# EAGLE design Rtx_Power_Filter (EAGLE 6.5.0)
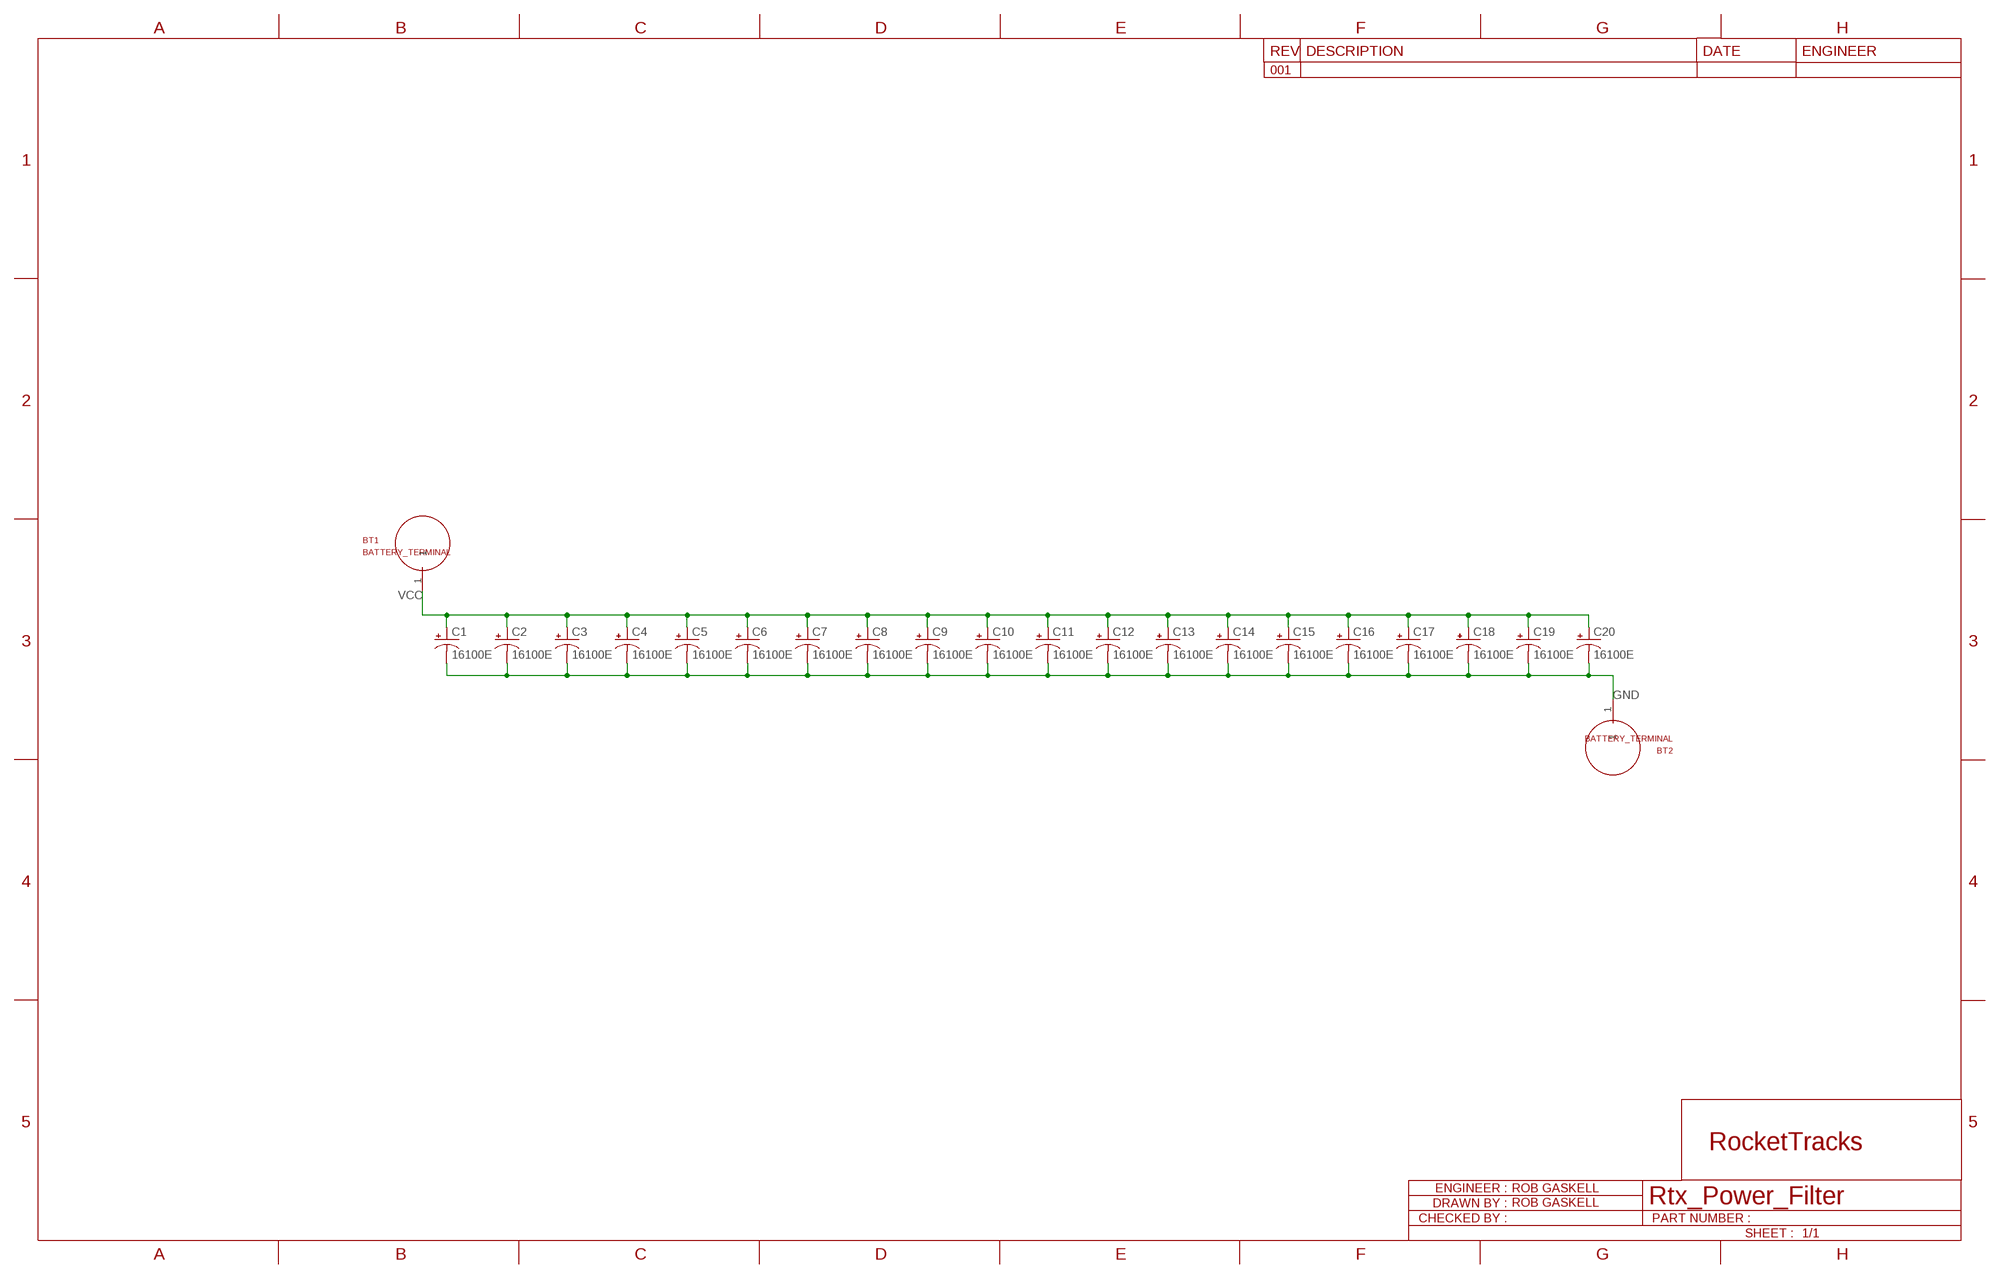
[diagram p0: schematic, sheet 1]

## Parts
BT1  BATTERY_TERMINAL  [BATTERY_TERMINAL]
BT2  BATTERY_TERMINAL  [BATTERY_TERMINAL]
C1  16100E  [16100]
C2  16100E  [16100]
C3  16100E  [16100]
C4  16100E  [16100]
C5  16100E  [16100]
C6  16100E  [16100]
C7  16100E  [16100]
C8  16100E  [16100]
C9  16100E  [16100]
C10  16100E  [16100]
C11  16100E  [16100]
C12  16100E  [16100]
C13  16100E  [16100]
C14  16100E  [16100]
C15  16100E  [16100]
C16  16100E  [16100]
C17  16100E  [16100]
C18  16100E  [16100]
C19  16100E  [16100]
C20  16100E  [16100]

## Nets
GND: BT2.1 C1.- C2.- C3.- C4.- C5.- C6.- C7.- C8.- C9.- C10.- C11.- C12.- C13.- C14.- C15.- C16.- C17.- C18.- C19.- C20.-
VCC: BT1.1 C1.+ C2.+ C3.+ C4.+ C5.+ C6.+ C7.+ C8.+ C9.+ C10.+ C11.+ C12.+ C13.+ C14.+ C15.+ C16.+ C17.+ C18.+ C19.+ C20.+

## Library data of the parts
BT1 BT2 = motorFeedback:BATTERY_TERMINAL
C1-C20 = motorFeedback:16100

## Board
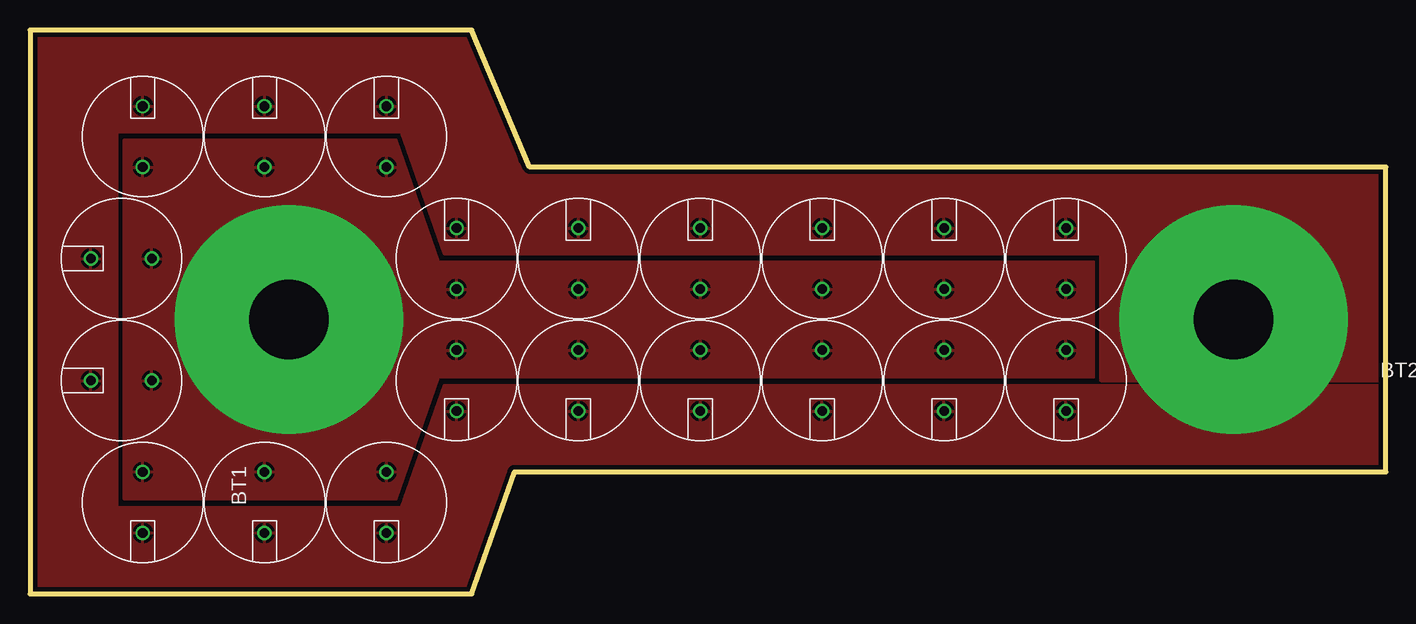
[diagram p1: board, top side]
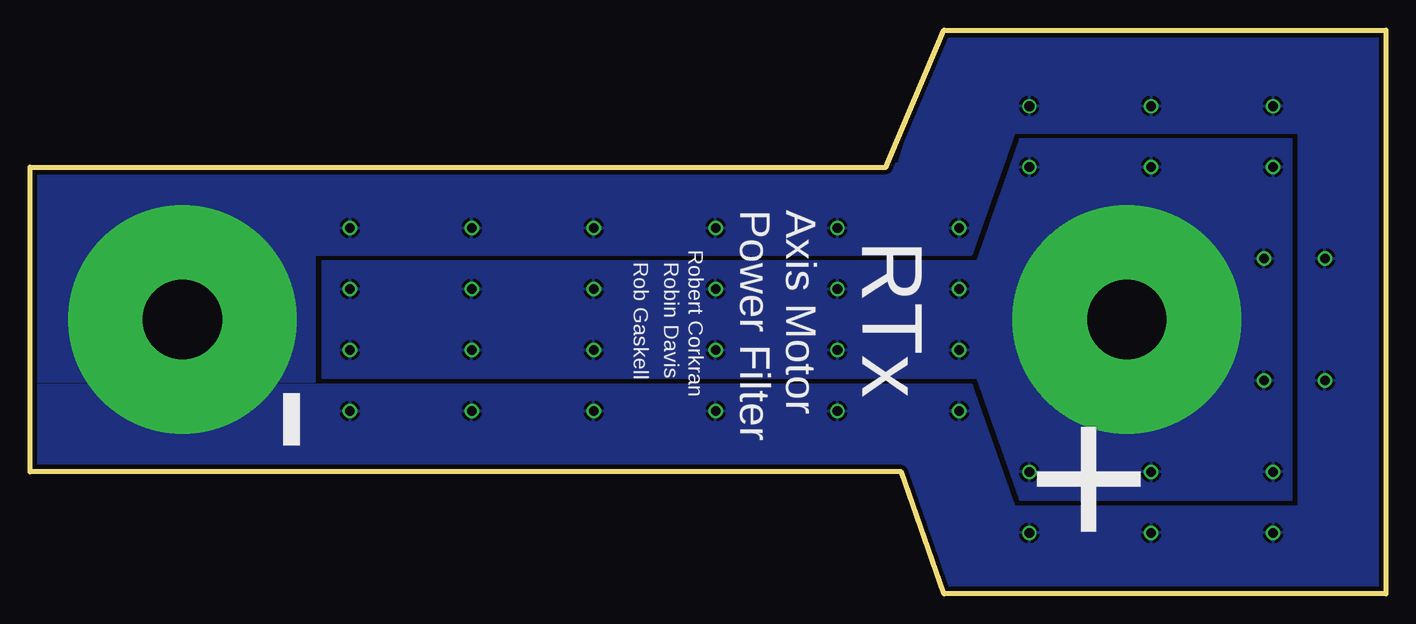
[diagram p2: board, bottom side, seen from below]

Size 113.03 x 46.99 mm. Coordinates in mm from the lower left corner, seen from the top.
Outline: 113.03,35.56 41.66,35.56 36.83,46.99 0,46.99 0,0 36.83,0 40.39,10.16 113.03,10.16 113.03,35.56
Copper layers (1*16): Top 0.0356mm / dielectric 1.5011mm / Bottom 0.0356mm
Design rules "osh-park-2layer": minimum track width 6mil, minimum drill 13mil, track to track 6mil, track to pad 6mil, pad to pad 6mil, via to via 6mil, smd to smd 6mil, copper to edge 15mil, drill to drill 6mil, minimum pad ring 7mil, minimum via ring 7mil, stop-mask expansion 3mil, vias tented up to drill 0mil, thermal gap 10mil

### Footprints (pad centres in the part's own frame; a part is rotated, then mirrored left to right if it is on the bottom)
BATTERY_TERMINAL = drill 6.604 pad 19.05: 1 0,0
16100 = drill 0.8: + -2.54,0; - 2.54,0

### Placement (x,y rotation side)
BT1  21.59,22.86 90 top
BT2  100.33,22.86 180 top
C1  29.72,7.62 270 top
C2  35.56,17.78 270 top
C3  45.72,17.78 270 top
C4  55.88,17.78 270 top
C5  66.04,17.78 270 top
C6  76.2,17.78 270 top
C7  19.56,7.62 270 top
C8  9.4,7.62 270 top
C9  7.62,17.78 180 top
C10  86.36,17.78 270 top
C11  7.62,27.94 180 top
C12  9.4,38.1 90 top
C13  19.56,38.1 90 top
C14  55.88,27.94 90 top
C15  45.72,27.94 90 top
C16  66.04,27.94 90 top
C17  35.56,27.94 90 top
C18  76.2,27.94 90 top
C19  29.72,38.1 90 top
C20  86.36,27.94 90 top

### Tracks (layer width: path | path; a pad name or v marks a point on that pad's centre or on a via)
GND
  pour Bottom: 113.28,9.91 40.64,9.91 37.08,-0.25 -0.25,-0.25 -0.25,47.24 37.08,47.24 40.64,35.81 113.28,35.81 113.39,17.73 89.28,17.73 89.28,28.32 34.54,28.32 30.99,38.48 7.24,38.48 7.24,7.24 30.99,7.24 34.54,17.4 113.28,17.4
  pour Top: 113.28,9.91 40.64,9.91 37.08,-0.25 -0.25,-0.25 -0.25,47.24 37.08,47.24 40.64,35.81 113.28,35.81 113.39,17.73 89.28,17.73 89.28,28.32 34.54,28.32 30.99,38.48 7.24,38.48 7.24,7.24 30.99,7.24 34.54,17.4 113.28,17.4
VCC
  pour Bottom: 88.65,18.03 34.04,18.03 30.48,7.87 7.87,7.87 7.87,37.85 30.48,37.85 34.04,27.69 88.65,27.69
  pour Top: 88.65,18.03 34.04,18.03 30.48,7.87 7.87,7.87 7.87,37.85 30.48,37.85 34.04,27.69 88.65,27.69

### Text on the board
bPlace: Axis Motor / Power Filter | RTx | Robert Corkran | Robin Davis | Rob Gaskell | - | +